# Altium schematic sheet 1_IIP_Charge.SchDoc
size A4; Organization: SpaceLab UFSC; Address1: UFSC - SpaceLab; Address2: University Campus - Trindade; Address3: Dep. of Electrical Engineering - CTC; Address4: Florianópolis, Santa Catarina, Brazil; DocumentNumber: 2; Revision: 1.0; SheetNumber: 2; SheetTotal: 2; Address5: CEP: 88040 - 900
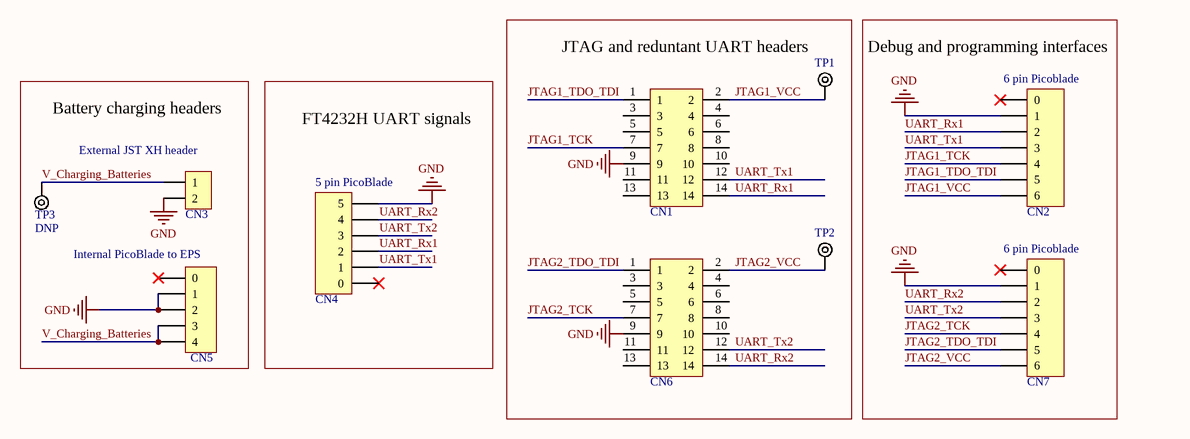
[diagram p0: 1_IIP_Charge.SchDoc]

## Parts
CN1  7 POS dual line Pin Header 2.54mm  [CONN HEADER VERT 14POS 2.54MM]  (value not drawn)
CN2  6 pin Picoblade  [PICO BLADE 0533980671]
CN3  JST 2 position header 2.5mm  [B2B-XH-A-M(LF)(SN)]  (value not drawn)
CN4  5 pin PicoBlade  [PICO BLADE 0533980571]
CN5  4 pin Picoblade  [PICO BLADE 0533980471]  (value not drawn)
CN6  7 POS dual line Pin Header 2.54mm  [CONN HEADER VERT 14POS 2.54MM]  (value not drawn)
CN7  6 pin Picoblade  [PICO BLADE 0533980671]
TP1  DNP  [TEST POINT PTH]  (value not drawn)  (no BOM)
TP2  DNP  [TEST POINT PTH]  (value not drawn)  (no BOM)
TP3  DNP  [TEST POINT PTH]  (no BOM)

## Blocks framed on the sheet
JTAG and reduntant UART headers: CN1 CN6 TP1 TP2
Debug and programming interfaces: CN2 CN7
Battery charging headers: CN3 CN5 TP3
FT4232H UART signals: CN4

## Nets
GND: CN1.9 CN2.1 CN3.2 CN4.5 CN5.1 CN5.2 CN6.9 CN7.1
JTAG1_TCK: CN1.7 CN2.4
JTAG1_TDO_TDI: CN1.1 CN2.5
JTAG1_VCC: CN1.2 CN2.6 TP1.1
JTAG2_TCK: CN6.7 CN7.4
JTAG2_TDO_TDI: CN6.1 CN7.5
JTAG2_VCC: CN6.2 CN7.6 TP2.1
UART_Rx1: CN1.14 CN2.2 CN4.2
UART_Rx2: CN4.4 CN6.14 CN7.2
UART_Tx1: CN1.12 CN2.3 CN4.1
UART_Tx2: CN4.3 CN6.12 CN7.3
V_Charging_Batteries: CN3.1 CN5.3 CN5.4 TP3.1

Not connected (* = marked no-connect by the designer): CN1 3 4 5 6 8 10 11 13; CN2 0*; CN4 0*; CN5 0*; CN6 3 4 5 6 8 10 11 13; CN7 0*

## Notes on the sheet
- (near CN3) External JST XH header
- (near CN5) Internal PicoBlade to EPS
- Date:
- Title:
- Size:
- A4
- Project:
- Time:
- Sheet
- of
- Revision:
- UFSC - SpaceLab
- University Campus - Trindade
- Dep. of Electrical Engineering - CTC
- Florianópolis, Santa Catarina, Brazil
- CEP: 88040 - 900
- Drawn By:
- Model:

## Library data of the parts
CN1 CN6 = M20-9980745: Headers & Wire Housings 07+07 DIL VERTICAL PIN HEADER GOLD HT; Manufacturer: Harwin; Number of Contacts: 14; Contact Resistance: 25mR; Max Current Rating: 3A; Gender: Male; Connector Type: Male Pin; Row Spacing: 0.1inch; Supplier 1: Digi-Key; Supplier Part Number 1: 952-1932-ND; Stock 1: 15564; Pricing 1: 1=0.54, 10=0.51, 100=0.391, 500=0.34, 1000=0.2805, 5000=0.2465, 10000=0.2295 (USD); Mount: Through Hole; Contact Plating: Gold; Contact Material: Brass; Color: Black; Housing Color: Black; Housing Material: Nylon; Min Operating Temperature: -40°C; Max Operating Temperature: 105°C; Number of Rows: 2; Termination: Solder; Package Quantity: 500; Packaging: Bag; Number of Positions: 14; Orientation: Straight; Length: 17.78mm; Pitch: 2.54mm; Contact Mating Length: 0.24inch; Depth: 5.08mm; Radiation Hardening: No; REACH SVHC: No SVHC; ComponentLink1URL: https://www.verical.com/server-webapp/html/getDatasheet?partID=468550&src-supplier=Verical; ComponentLink1Description: https://www.verical.com/server-webapp/html/getDatasheet?partID=468550&src-supplier=Verical; ComponentLink2URL: http://www.harwin.com/include/downloads/drawings/M20-998.PDF?src-supplier=Element14; ComponentLink2Description: http://www.harwin.com/include/downloads/drawings/M20-998.PDF?src-supplier=Element14; ComponentLink3URL: http://www.mouser.com/ds/2/181/M20-998-351176.pdf?src-supplier=Mouser; ComponentLink3Description: http://www.mouser.com/ds/2/181/M20-998-351176.pdf?src-supplier=Mouser; Supplier 2: Mouser; Supplier Part Number 2: 855-M20-9980745; Stock 2: 1790; Pricing 2: 1=0.54, 10=0.51, 100=0.387, 500=0.34, 1000=0.28, 2500=0.246 (USD); Manufacturer Part Number: M20-9980745
CN2 CN7 = 53398-0671: 1.25mm Pitch PicoBlade™ Header, Surface Mount, Vertical, 6 Circuits; Manufacturer: Molex; Body Plating: Tin; Contact Resistance: 20mR; Voltage Rating: 125V; Current Rating: 1A; Number of Positions: 6; Insulation Resistance: 100MR; Gender: Male; Glow Wire Compliant: Non-compliant; Supplier 1: Digi-Key; Supplier Part Number 1: WM7610DKR-ND; Stock 1: 21086; Pricing 1: 1=1.39, 10=1.26, 100=1.0802, 500=0.90014 (USD); Mount: Surface Mount; Color: Natural; Contact Plating: Tin; Contact Material: Bronze,Tin; Housing Color: Natural; Housing Material: Nylon; Min Operating Temperature: -40°C; Max Operating Temperature: 85°C; Packaging: Tape and Reel; Number of Rows: 1; Voltage Rating (AC): 125V; Package Quantity: 1000; Termination: Solder; Number of Contacts: 6; Working Voltage: 125V; Orientation: Vertical; Number of Circuits: 6; Voltage Rating (DC): 125V; Lead Pitch: 1.25mm; Pitch: 1.25mm; Radiation Hardening: No; REACH SVHC: Unknown; Lead Free: Lead Free; Flammability Rating: UL94 V-0; ComponentLink1URL: https://www.molex.com/pdm_docs/sd/533980671_sd.pdf?src-supplier=Digi-Key; ComponentLink1Description: https://www.molex.com/pdm_docs/sd/533980671_sd.pdf?src-supplier=Digi-Key; Supplier 2: Mouser; Supplier Part Number 2: 538-53398-0671; Stock 2: 26; Pricing 2: 1=1.15, 10=1.01, 100=0.864, 500=0.727, 1000=0.427, 2000=0.374 (USD); Manufacturer Part Number: 53398-0671
CN3 = B2B-XH-A-M(LF)(SN): CONN HEADER TOP 2POS 2.5MM GRN; Number of Positions: 2; Connector Type: Male Pin; Pitch: 0.098inch; Supplier 1: Digi-Key; Supplier Part Number 1: 455-2879-ND; Manufacturer: JST; Stock 1: 5564; Pricing 1: 1=0.17, 10=0.157, 100=0.0966, 500=0.07998, 1000=0.06999, 5000=0.05999, 10000=0.05832 (USD); Mount: Through Hole; Color: Natural; Contact Plating: Tin; Packaging: Bulk; Number of Rows: 1; Termination: Press-Fit; Fastening Type: Detent; Package Quantity: 1000; Manufacturer Part Number: B2B-XH-A-M(LF)(SN); ComponentLink1Description: http://www.jst-mfg.com/product/pdf/eng/eXH.pdf; ComponentLink1URL: http://www.jst-mfg.com/product/pdf/eng/eXH.pdf
CN4 = 53398-0571: Wire-To-Board Connector, Vertical, PicoBlade 53398 Series, Surface Mount, Header, 5, 1.25 mm; Manufacturer: Molex; Body Plating: Tin; Current Rating: 1A; Voltage Rating (AC): 125V; Contact Resistance: 20mR; Number of Positions: 5; Insulation Resistance: 100MR; Gender: Male; Pitch: 1.25mm; Glow Wire Compliant: Non-compliant; Supplier 1: Digi-Key; Supplier Part Number 1: WM7609CT-ND; Stock 1: 427; Pricing 1: 1=1.32, 10=1.159, 100=0.9999, 500=0.81814 (USD); Mount: Surface Mount; Contact Plating: Tin; Color: Natural; Contact Material: Bronze,Tin,Brass; Housing Color: Natural; Housing Material: Nylon; Min Operating Temperature: -40°C; Max Operating Temperature: 85°C; Packaging: Tape and Reel; Orientation: Vertical; Number of Rows: 1; Voltage Rating: 125V; Max Voltage Rating (AC): 125V; Package Quantity: 1000; Contact Gender: Male; Termination: Solder; Number of Contacts: 5; Working Voltage: 125V; Number of Circuits: 5; Voltage Rating (DC): 125V; Lead Pitch: 1.25mm; Radiation Hardening: No; Flammability Rating: UL94 V-0; REACH SVHC: Unknown; Lead Free: Lead Free; ComponentLink1URL: http://www.molex.com/webdocs/datasheets/pdf/en-us/0533980571_PCB_HEADERS.pdf?src-supplier=Avnet+Europe; ComponentLink1Description: http://www.molex.com/webdocs/datasheets/pdf/en-us/0533980571_PCB_HEADERS.pdf?src-supplier=Avnet+Europe; ComponentLink2URL: http://www.farnell.com/datasheets/2697810.pdf?src-supplier=Newark; ComponentLink2Description: http://www.farnell.com/datasheets/2697810.pdf?src-supplier=Newark; ComponentLink3URL: https://www.distrelec.biz/Web/Downloads/46/_e/gf116833-116846_e.pdf?mime=application%2Fpdf&src-supplier=Distrelec; ComponentLink3Description: https://www.distrelec.biz/Web/Downloads/46/_e/gf116833-116846_e.pdf?mime=application%2Fpdf&src-supplier=Distrelec; ComponentLink4URL: http://www.farnell.com/datasheets/1632115.pdf?src-supplier=Element14; ComponentLink4Description: http://www.farnell.com/datasheets/1632115.pdf?src-supplier=Element14; ComponentLink5URL: http://uk.rs-online.com/webdocs/078f/0900766b8078fc92.pdf?src-supplier=RSComponents; ComponentLink5Description: http://uk.rs-online.com/webdocs/078f/0900766b8078fc92.pdf?src-supplier=RSComponents; ComponentLink6URL: http://www.farnell.com/datasheets/1867377.pdf?src-supplier=Element14; ComponentLink6Description: http://www.farnell.com/datasheets/1867377.pdf?src-supplier=Element14; ComponentLink7URL: http://www.farnell.com/datasheets/1626108.pdf?src-supplier=Element14; ComponentLink7Description: http://www.farnell.com/datasheets/1626108.pdf?src-supplier=Element14; ComponentLink8URL: http://www.mouser.com/ds/2/276/0533980571_PCB_HEADERS-146486.pdf?src-supplier=Mouser; ComponentLink8Description: http://www.mouser.com/ds/2/276/0533980571_PCB_HEADERS-146486.pdf?src-supplier=Mouser; Supplier 2: Mouser; Supplier Part Number 2: 538-53398-0571; Stock 2: 35606; Pricing 2: 1=1.32, 10=1.15, 100=0.999, 500=0.818, 1000=0.389, 2000=0.342 (USD); Manufacturer Part Number: 53398-0571
CN5 = 0533980471: Connector Header Surface Mount 4 position 0.049" (1.25mm); Manufacturer: Molex; Manufacturer Part Number: 53398-0471; N of Positions: 4; Description: Conn Wire to Board HDR 4 POS 1.25mm Solder ST SMD Embossed T/R; Body Plating: Tin; Gender: Male; Current Rating: 1A; Voltage Rating: 125V; Contact Resistance: 20mR; Insulation Resistance: 100MR; Glow Wire Compliant: Non-compliant; Pitch: 1.25mm; Mount Type: SMD; Value: 0533980471; Supplier 1: Digi-Key; Supplier Part Number 1: WM7608CT-ND; Stock 1: 21236; Pricing 1: 1=1.19, 10=1.044, 100=0.901, 500=0.73716 (USD); Mount: Surface Mount; Contact Plating: Tin; Contact Material: Bronze,Tin,Brass; Color: Natural; Housing Color: Natural; Housing Material: Nylon; Min Operating Temperature: -40°C; Max Operating Temperature: 85°C; Number of Rows: 1; Packaging: Tape and Reel; Number of Positions: 4; Termination: Solder; Package Quantity: 1000; Voltage Rating (AC): 125V; Number of Contacts: 4; Working Voltage: 125V; Orientation: Vertical; Number of Circuits: 4; Voltage Rating (DC): 125V; Lead Pitch: 1.25mm; Radiation Hardening: No; Flammability Rating: UL94 V-0; REACH SVHC: Unknown; Lead Free: Lead Free; ComponentLink1URL: http://www.mouser.com/ds/2/276/0533980471_PCB_HEADERS-171069.pdf?src-supplier=Mouser; ComponentLink1Description: http://www.mouser.com/ds/2/276/0533980471_PCB_HEADERS-171069.pdf?src-supplier=Mouser; ComponentLink2URL: http://www.jameco.com/Jameco/Products/ProdDS/1932627.pdf?src-supplier=Jameco; ComponentLink2Description: http://www.jameco.com/Jameco/Products/ProdDS/1932627.pdf?src-supplier=Jameco; ComponentLink3URL: https://www.distrelec.biz/Web/Downloads/46/_e/gf116833-116846_e.pdf?mime=application%2Fpdf&src-supplier=Distrelec; ComponentLink3Description: https://www.distrelec.biz/Web/Downloads/46/_e/gf116833-116846_e.pdf?mime=application%2Fpdf&src-supplier=Distrelec; ComponentLink4URL: http://www.molex.com/webdocs/datasheets/pdf/en-us/0533980471_PCB_HEADERS.pdf?src-supplier=Element14; ComponentLink4Description: http://www.molex.com/webdocs/datasheets/pdf/en-us/0533980471_PCB_HEADERS.pdf?src-supplier=Element14; ComponentLink5URL: http://www.farnell.com/datasheets/1867381.pdf?src-supplier=Element14; ComponentLink5Description: http://www.farnell.com/datasheets/1867381.pdf?src-supplier=Element14; ComponentLink6URL: http://uk.rs-online.com/webdocs/13c4/0900766b813c4500.pdf?src-supplier=RSComponents; ComponentLink6Description: http://uk.rs-online.com/webdocs/13c4/0900766b813c4500.pdf?src-supplier=RSComponents; ComponentLink7URL: http://www.molex.com/webdocs/datasheets/pdf/en-us/0533980471_PCB_HEADERS.pdf?src-supplier=Farnell; ComponentLink7Description: http://www.molex.com/webdocs/datasheets/pdf/en-us/0533980471_PCB_HEADERS.pdf?src-supplier=Farnell; ComponentLink8URL: http://www.farnell.com/datasheets/2697809.pdf?src-supplier=Element14; ComponentLink8Description: http://www.farnell.com/datasheets/2697809.pdf?src-supplier=Element14; ComponentLink9URL: http://www.molex.com/webdocs/datasheets/pdf/en-us/0533980471_PCB_HEADERS.pdf?src-supplier=Avnet; ComponentLink9Description: http://www.molex.com/webdocs/datasheets/pdf/en-us/0533980471_PCB_HEADERS.pdf?src-supplier=Avnet; ComponentLink10URL: http://www.molex.com/webdocs/datasheets/pdf/en-us/0533980471_PCB_HEADERS.pdf?src-supplier=Avnet+Europe; ComponentLink10Description: http://www.molex.com/webdocs/datasheets/pdf/en-us/0533980471_PCB_HEADERS.pdf?src-supplier=Avnet+Europe; Supplier 2: Mouser; Supplier Part Number 2: 538-53398-0471; Stock 2: 43680; Pricing 2: 1=0.98, 10=0.832, 100=0.716, 500=0.6, 1000=0.391, 2000=0.342 (USD)
TP1-TP3 = Test Point PTH: TEST POINT PAD